# Altium schematic sheet bb_power_motdrvs.SchDoc
size A4; SheetNumber: 3; SheetTotal: 6
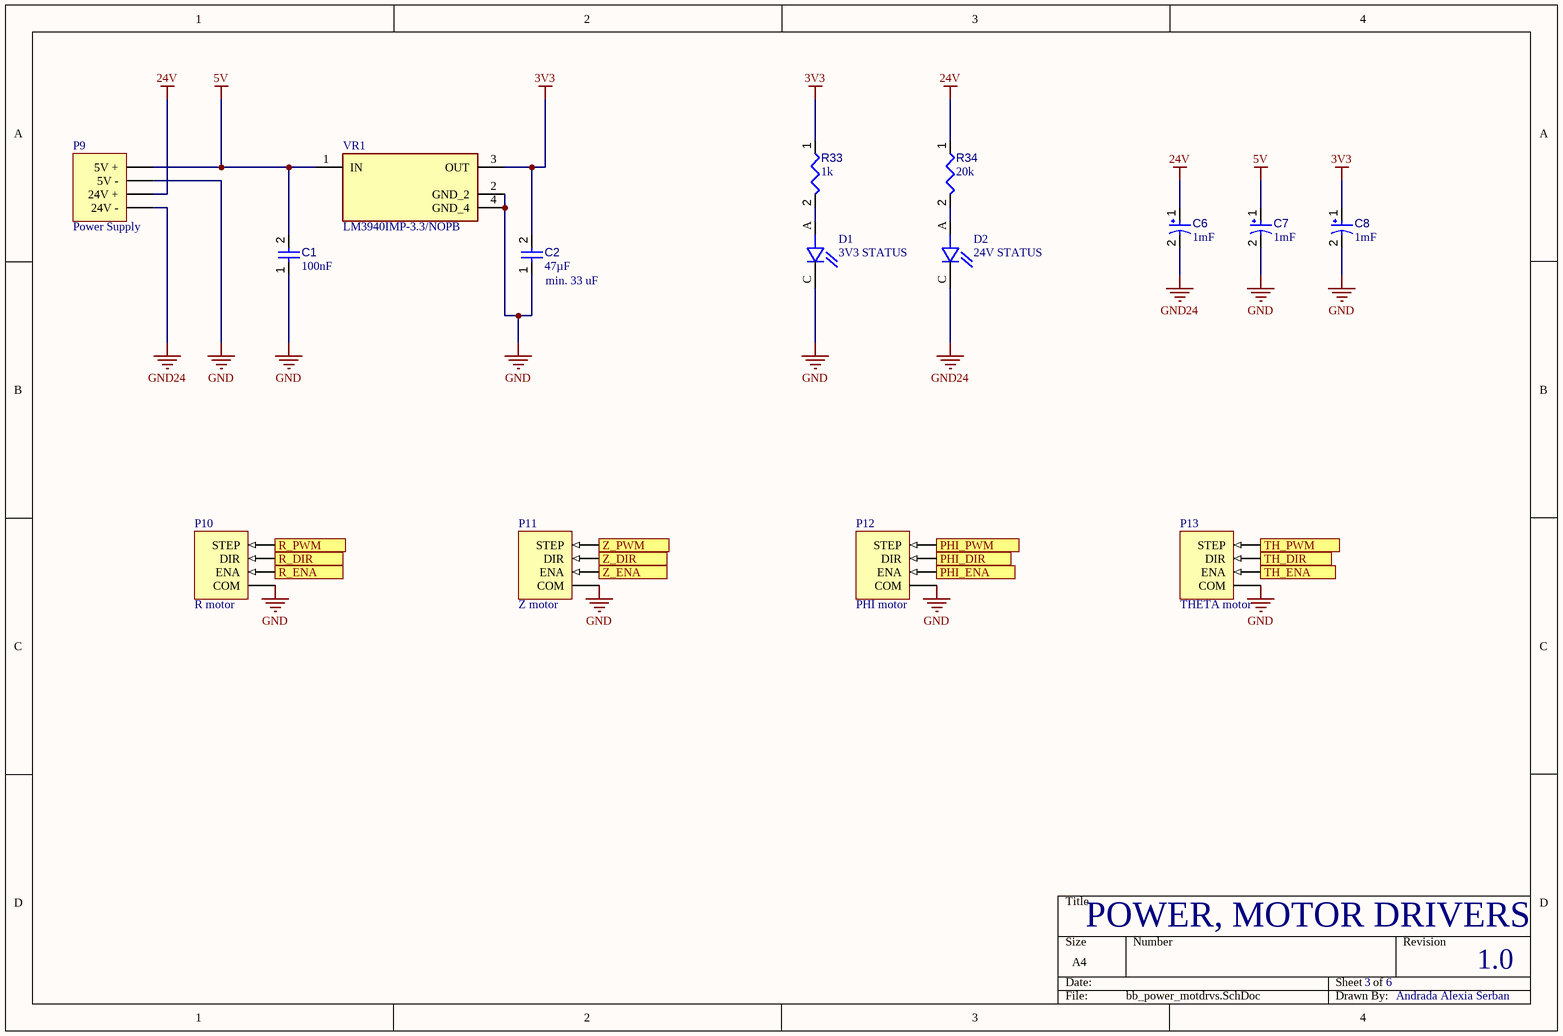
[diagram p0: bb_power_motdrvs.SchDoc]

## Parts
C1  value 100nF  [CAPC2013X145X50ML20T25]  (hidden comment: Capacitor 1 uF +/- 10% 25 V 0805)
C2  value 47µF  [CAPC0805(2012)145_L]  (hidden comment: Capacitor 47µF +/-40% 6.3V 0805)
C6  value 1mF  [CAPPR65-500-2000X1000X2200]  (hidden comment: ECA1EM102)
C7  value 1mF  [CAPPR65-500-2000X1000X2200]  (hidden comment: ECA1EM102)
C8  value 1mF  [CAPPR65-500-2000X1000X2200]  (hidden comment: ECA1EM102)
D1  3V3 STATUS  [LEDC2012X70N]
D2  24V STATUS  [LEDC2012X70N]
P9  Power Supply  [FP_CONN4_STELVIO_MRT9-3,81]
P10  R motor  [FP_CONN4_STELVIO_MRT9-3,81]
P11  Z motor  [FP_CONN4_STELVIO_MRT9-3,81]
P12  PHI motor  [FP_CONN4_STELVIO_MRT9-3,81]
P13  THETA motor  [FP_CONN4_STELVIO_MRT9-3,81]
R33  value 1k  [RESC0402(1005)_L]  (hidden comment: Resistor 200R +/-5 % 0402 63 mW)
R34  value 20k  [RESC0402(1005)_L]  (hidden comment: Resistor 200R +/-5 % 0402 63 mW)
VR1  LM3940IMP-3.3/NOPB  [VREG_LM3940IMP-3.3/NOPB]

## Ports
PHI_DIR (in, see bb_Nucleo[1C]), PHI_ENA (in, see bb_Nucleo[1C]), PHI_PWM (in, see bb_Nucleo[1C]), R_DIR (in, see bb_Nucleo[3B]), R_ENA (in, see bb_Nucleo[3C]), R_PWM (in, see bb_Nucleo[3B]), TH_DIR (in, see bb_Nucleo[4C]), TH_ENA (in, see bb_Nucleo[4C]), TH_PWM (in, see bb_Nucleo[1C]), Z_DIR (in, see bb_Nucleo[3B]), Z_ENA (in, see bb_Nucleo[3B]), Z_PWM (in, see bb_Nucleo[3B])

## Nets
3V3: C2.2 C8.1 R33.1 VR1.3(OUT)
5V: C1.2 C7.1 P9.4(5V_+) VR1.1(IN)
24V: C6.1 P9.2(24V_+) R34.1
GND: C1.1 C2.1 C7.2 C8.2 D1.C P9.3(5V_-) P10.1(COM) P11.1(COM) P12.1(COM) P13.1(COM) VR1.2(GND_2) VR1.4(GND_4)
GND24: C6.2 D2.C P9.1(24V_-)
PHI_DIR: P12.3(DIR) ; port PHI_DIR
PHI_ENA: P12.2(ENA) ; port PHI_ENA
PHI_PWM: P12.4(STEP) ; port PHI_PWM
R_DIR: P10.3(DIR) ; port R_DIR
R_ENA: P10.2(ENA) ; port R_ENA
R_PWM: P10.4(STEP) ; port R_PWM
TH_DIR: P13.3(DIR) ; port TH_DIR
TH_ENA: P13.2(ENA) ; port TH_ENA
TH_PWM: P13.4(STEP) ; port TH_PWM
Z_DIR: P11.3(DIR) ; port Z_DIR
Z_ENA: P11.2(ENA) ; port Z_ENA
Z_PWM: P11.4(STEP) ; port Z_PWM
NetD1_A: D1.A R33.2
NetD2_A: D2.A R34.2

## Notes on the sheet
- (near C2) min. 33 uF
- POWER, MOTOR DRIVERS
- 3
- 6
- 1.0
- Andrada Alexia Serban

## Library data of the parts
C1 = CMP-001-00010-6: Chip Capacitor, 1 uF, +/-10%, 25 V, 0805 (2012 Metric); Capacitor Type: Ceramic; Voltage Rating: 25V; RoHS Compliant: True; Pins: 2; Mounting Technology: SM; Max Operating Temperature: 125°C; Min Operating Temperature: -55°C; Tolerance: 10%; Case/Package: 0805
C2 = CMP-001-00082-4: Chip Capacitor, 47µF +/-40%, 6.3V, 0805, Thickness 1.45 mm; Tolerance: 10%; Min Operating Temperature: -55°C; Max Operating Temperature: 85°C; Case/Package: 0805; Pins: 2; Mounting Technology: SMT; Voltage Rating: 6.3V
C6-C8 = CMP-001-00023-8: Aluminum Electrolytic Capacitor, 1000 uF, +/- 20%, 25 V, -40 to 85 degC, 2-Pin THD, RoHS, Bulk; Manufacturer: Panasonic; Ripple Current: 850mA; Voltage Rating: 25V; Lead Pitch: 5mm; Datasheet URL: https://industrial.panasonic.com/cdbs/www-data/pdf/RDF0000/ABA0000C1218.pdf; Packaging: Bulk; Package Reference: CAPPR65-500-2000X1000X2200; Package Description: 2-Pin Radial Lead, Dia 10 mm, Height 22 mm; Diameter: 10mm; Min Operating Temperature: -40°C; Datasheet Version: Rev. 05, 10/2016; RoHS Compliant: True; Capacitor Type: Electrolytic; Tolerance: 20%; Mounting Technology: TH; Manufacturer URL: http://www.panasonic.com/; Max Operating Temperature: 85°C; Package Quantity: 200; Case/Package: Radial
D1 D2 = CMP-030-000000-1: Green 566nm LED Indication - Discrete 2V 0805 _2012 Metric_; MF: Dialight; Digi-Key_Part_Number: 350-2044-1-ND; MP: 5988170107F; Source: SnapEDAsch.SchLib; Package: 0805 Dialight; SnapEDA_Link: https://www.snapeda.com/parts/5988170107F/Dialight/view-part/3077305/?ref=snap; Component Type: Standard; Pin Count: 2; Design Item ID: 5988170107F; Digi-Key_Purchase_URL: https://www.digikey.com/product-detail/en/dialight/5988170107F/350-2044-1-ND/1291348?utm_source=snapeda&utm_medium=aggregator&utm_campaign=symbol; Value: *
P9-P13 = Connector_4pin: 4pin Connector
R33 R34 = CMP-009-00161-3: Chip Resistor, 200 Ohms, +/-5 %, 63 mW, -55 to 155 degC, 0402; Power: 63mW; Tolerance: 5%; Min Operating Temperature: -55°C; Case/Package: 0402; Max Operating Temperature: 155°C; Pins: 2
VR1 = CMP-019-000000-1: Đ›Đ¸Đ˝ĐµĐąĐ˝Ń‹Đą ŃŃ‚Đ°Đ±Đ¸Đ»Đ¸Đ·Đ°Ń‚ĐľŃ€ Đ˝Đ°ĐżŃ€ŃŹĐ¶ĐµĐ˝Đ¸ŃŹ IC 1 Output 1A SOT-223-4; MF: National Semiconductor; MP: LM3940IMP33; Value: *; Design Item ID: LM3940IMP-3.3/NOPB; Source: LM3940IMP-3.3_NOPB.SchLib; Price: None; Pin Count: 4; Availability: Unavailable; SnapEDA_Link: https://www.snapeda.com/parts/LM3940IMP33/Texas%20Instruments/view-part/21631/?ref=snap; Package: SOT-223-4 National Semiconductor; Component Type: Standard; Check_prices: https://www.snapeda.com/parts/LM3940IMP33/Texas%20Instruments/view-part/21631/?ref=eda